# Altium schematic sheet USB_MUX.SchDoc: USB MUX
size A3; Author: Silvio Navaretti; CompanyName: ARDUINO; DrawnBy: Silvio Navaretti; Engineer: Silvio Navaretti; Organization: ARDUINO; SheetNumber: 32; SheetTotal: 51; RevAuthor: Silvio Navaretti
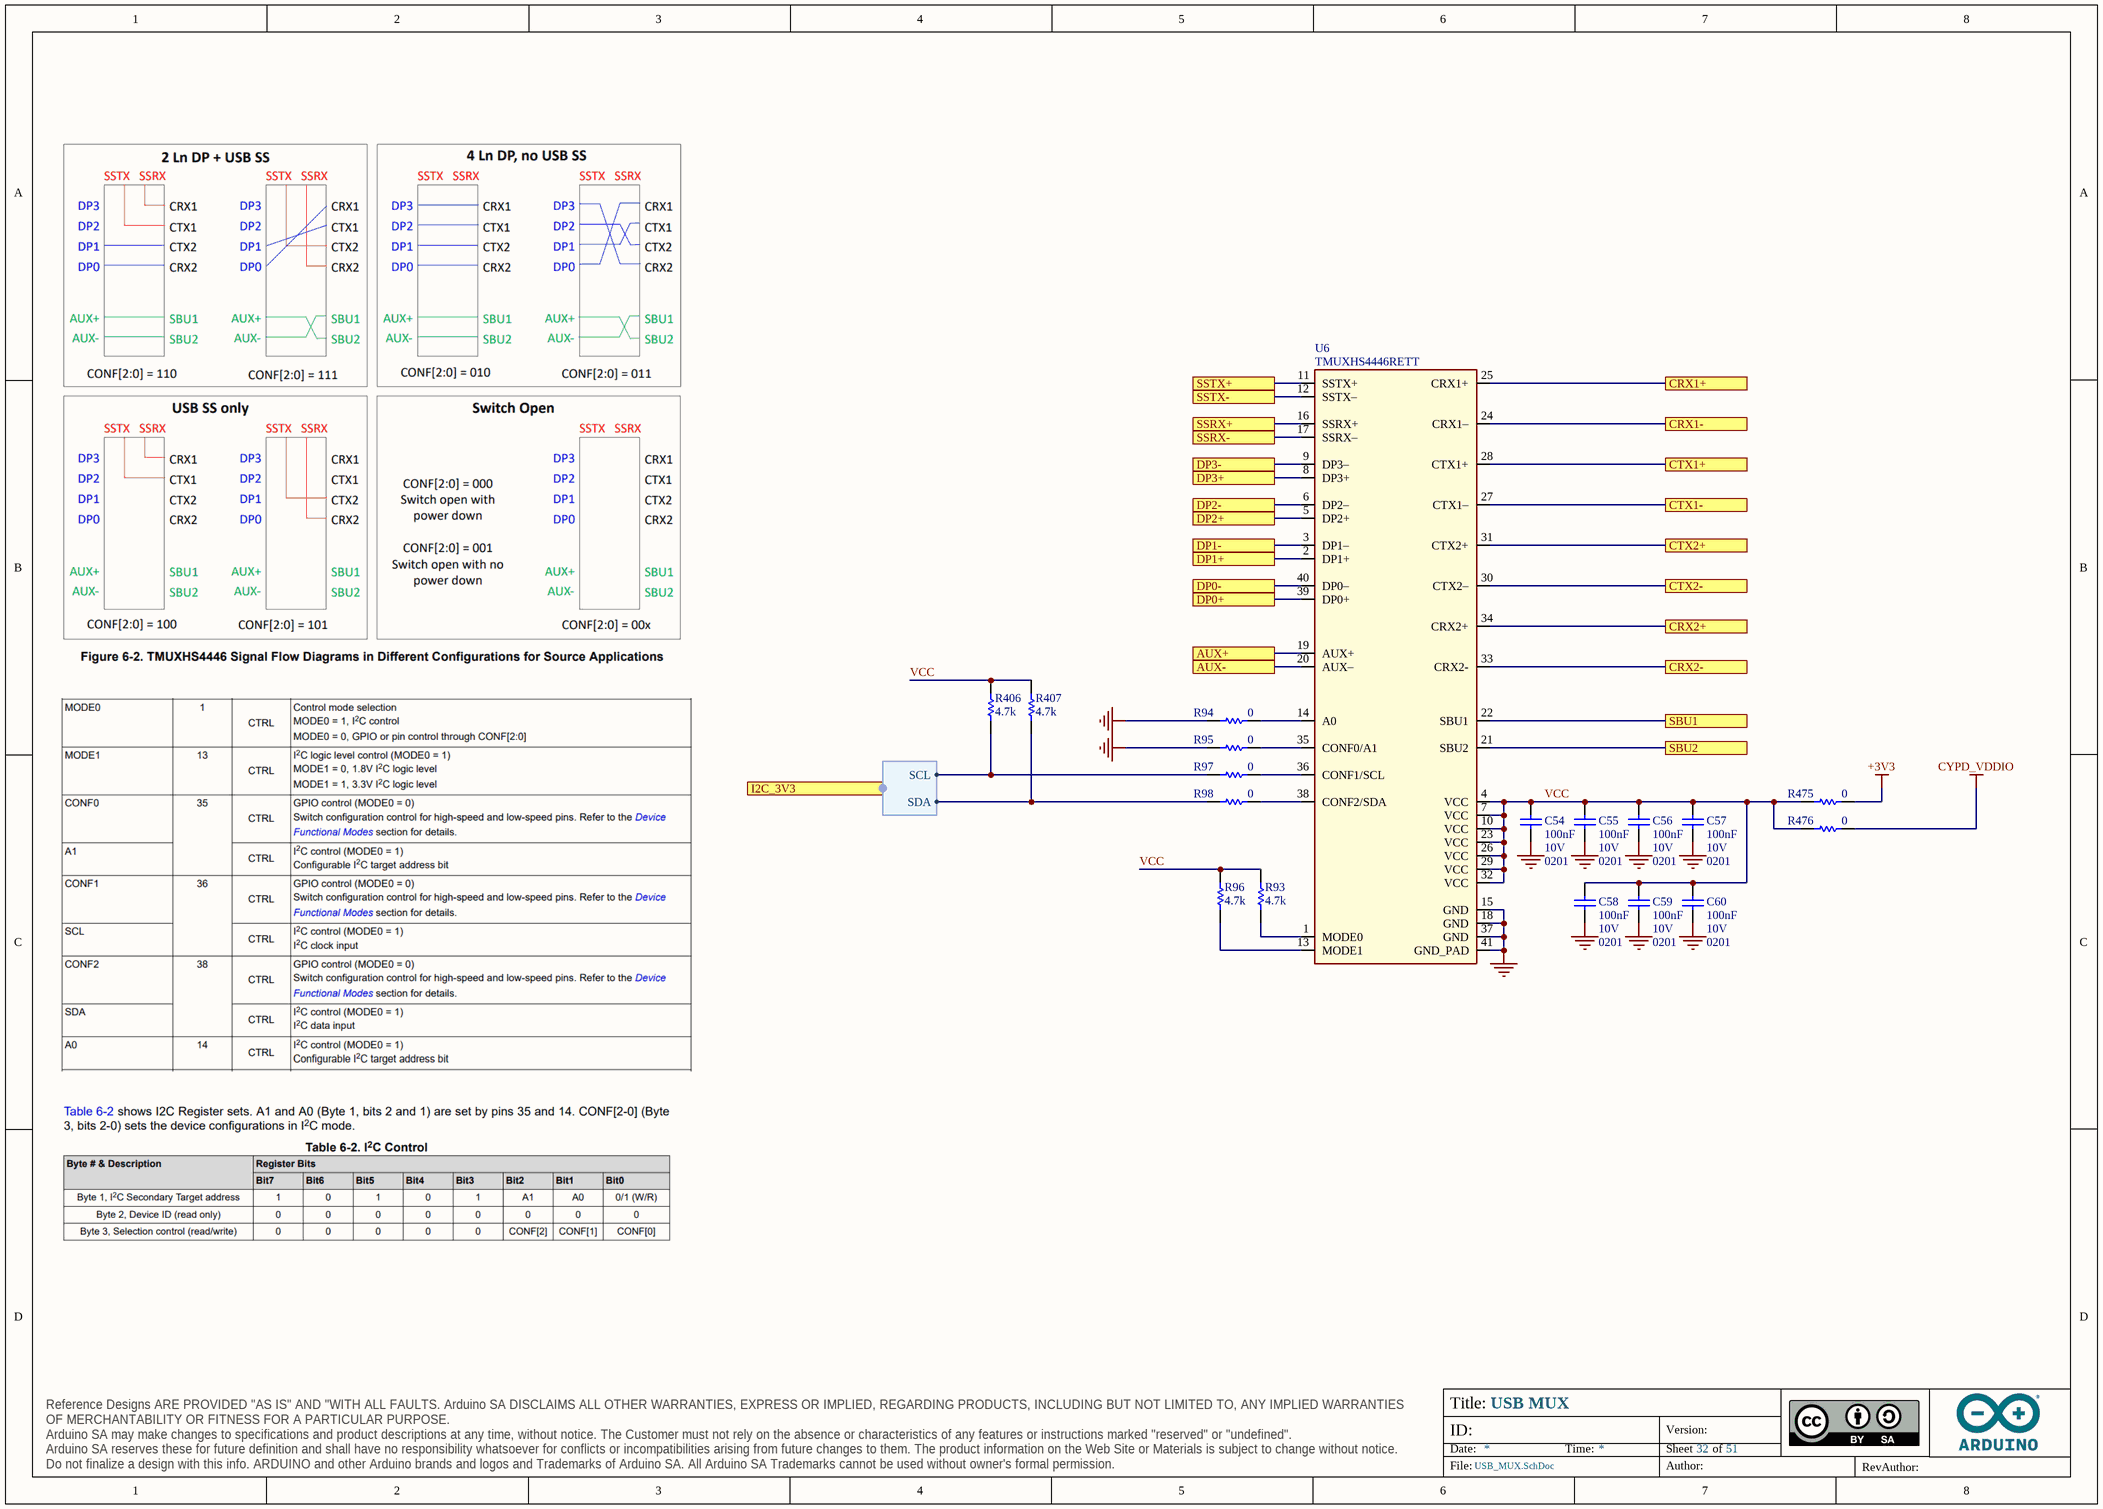
[diagram p0: USB_MUX.SchDoc]

## Parts
C54  value 100nF  Voltage: 10V  Case Code (Imperial): 0201  [CAP-0201]  (hidden comment: CL03A104KP3NNNC)
C55  value 100nF  Voltage: 10V  Case Code (Imperial): 0201  [CAP-0201]  (hidden comment: CL03A104KP3NNNC)
C56  value 100nF  Voltage: 10V  Case Code (Imperial): 0201  [CAP-0201]  (hidden comment: CL03A104KP3NNNC)
C57  value 100nF  Voltage: 10V  Case Code (Imperial): 0201  [CAP-0201]  (hidden comment: CL03A104KP3NNNC)
C58  value 100nF  Voltage: 10V  Case Code (Imperial): 0201  [CAP-0201]  (hidden comment: CL03A104KP3NNNC)
C59  value 100nF  Voltage: 10V  Case Code (Imperial): 0201  [CAP-0201]  (hidden comment: CL03A104KP3NNNC)
C60  value 100nF  Voltage: 10V  Case Code (Imperial): 0201  [CAP-0201]  (hidden comment: CL03A104KP3NNNC)
R93  value 4.7k  [RES-0201]  (hidden comment: RC0201FR-074K7L)
R94  value 0  [RES-0201]  (hidden comment: CRCW02010000Z0ED)
R95  value 0  [RES-0201]  (hidden comment: CRCW02010000Z0ED)
R96  value 4.7k  [RES-0201]  (hidden comment: RC0201FR-074K7L)
R97  value 0  [RES-0201]  (hidden comment: CRCW02010000Z0ED)
R98  value 0  [RES-0201]  (hidden comment: CRCW02010000Z0ED)
R406  value 4.7k  [RES-0201]  (hidden comment: RC0201FR-074K7L)
R407  value 4.7k  [RES-0201]  (hidden comment: RC0201FR-074K7L)
R475  value 0  [RES-0201]  (hidden comment: CRCW02010000Z0ED)
R476  value 0  [RES-0201]  (hidden comment: CRCW02010000Z0ED)
U6  TMUXHS4446RETT  [TI QWFN40 RET0040A Pitch 0.4mm 3x6mm]

## Ports
AUX+, AUX-, CRX1+, CRX1-, CRX2+, CRX2-, CTX1+, CTX1-, CTX2+, CTX2-, DP0+, DP0-, DP1+, DP1-, DP2+, DP2-, DP3+, DP3-, I2C_3V3 (harness I2C), SBU1, SBU2, SSRX+, SSRX-, SSTX+, SSTX-

## Harnesses
I2C: SDA, SCL

## Nets
+3V3: R475.2
CYPD_VDDIO: R476.2
GND: C54.1 C55.1 C56.1 C57.1 C58.1 C59.1 C60.1 R94.1 R95.1 U6.15(GND) U6.18(GND) U6.37(GND) U6.41(GND_PAD)
AUX+: U6.19(AUX+) ; port AUX+
AUX-: U6.20(AUX–) ; port AUX-
CRX1+: U6.25(CRX1+) ; port CRX1+
CRX1-: U6.24(CRX1–) ; port CRX1-
CRX2+: U6.34(CRX2+) ; port CRX2+
CRX2-: U6.33(CRX2-) ; port CRX2-
CTX1+: U6.28(CTX1+) ; port CTX1+
CTX1-: U6.27(CTX1–) ; port CTX1-
CTX2+: U6.31(CTX2+) ; port CTX2+
CTX2-: U6.30(CTX2–) ; port CTX2-
DP0+: U6.39(DP0+) ; port DP0+
DP0-: U6.40(DP0–) ; port DP0-
DP1+: U6.2(DP1+) ; port DP1+
DP1-: U6.3(DP1–) ; port DP1-
DP2+: U6.5(DP2+) ; port DP2+
DP2-: U6.6(DP2–) ; port DP2-
DP3+: U6.8(DP3+) ; port DP3+
DP3-: U6.9(DP3–) ; port DP3-
SBU1: U6.22(SBU1) ; port SBU1
SBU2: U6.21(SBU2) ; port SBU2
SSRX+: U6.16(SSRX+) ; port SSRX+
SSRX-: U6.17(SSRX–) ; port SSRX-
SSTX+: U6.11(SSTX+) ; port SSTX+
SSTX-: U6.12(SSTX–) ; port SSTX-
VCC: C54.2 C55.2 C56.2 C57.2 C58.2 C59.2 C60.2 R93.1 R96.1 R406.1 R407.1 R475.1 R476.1 U6.4(VCC) U6.7(VCC) U6.10(VCC) U6.23(VCC) U6.26(VCC) U6.29(VCC) U6.32(VCC)
NetR93_2: R93.2 U6.1(MODE0)
NetR94_2: R94.2 U6.14(A0)
NetR95_2: R95.2 U6.35(CONF0/A1)
NetR96_2: R96.2 U6.13(MODE1)
NetR97_1: R97.1 R406.2 ; port I2C_3V3.SCL
NetR97_2: R97.2 U6.36(CONF1/SCL)
NetR98_1: R98.1 R407.2 ; port I2C_3V3.SDA
NetR98_2: R98.2 U6.38(CONF2/SDA)

## Notes on the sheet
- Title:
- ID:
- Date:
- Time:
- Version:
- Sheet
- of
- RevAuthor:
- Reference Designs ARE PROVIDED "AS IS" AND "WITH ALL FAULTS. Arduino SA DISCLAIMS ALL OTHER WARRANTIES, EXPRESS OR IMPLIED, REGARDING PRODUCTS, INCLUDING BUT NOT LIMITED TO, ANY IMPLIED WARRANTIES OF MERCHANTABILITY OR FITNESS FOR A PARTICULAR PURPOSE.
  Arduino SA may make changes to specifications and product descriptions at any time, without notice. The Customer must not rely on the absence or characteristics of any features or instructions marked "reserved" or "undefined".
  Arduino SA reserves these for future definition and shall have no responsibility whatsoever for conflicts or incompatibilities arising from future changes to them. The product information on the Web Site or Materials is subject to change without notice.
  Do not finalize a design with this info. ARDUINO and other Arduino brands and logos and Trademarks of Arduino SA. All Arduino SA Trademarks cannot be used without owner's formal permission.
- File:
- Author:

## Library data of the parts
C54-C60 = C0113-A.6: CAP CHIP 0201 100nF 10% 10V X5R; Manufacturer: Samsung Electro-Mechanics; Code Arduino: C0113; Technology: Ceramic; Part Number: CL03A104KP3NNNC; Dielectric: X5R; Tolerance: 10%
R93 R96 R406 R407 = R0151-A.21: RES CHIP 0201 4k7 1% 1/20W; Manufacturer: Yageo; Temperature coefficient: 200ppm; Power: 50mW; Code Arduino: A5521; Technology: Thick film; Case Code (Imperial): 0201; Part Number: RC0201FR-074K7L; Tolerance: 1%
R94 R95 R97 R98 R475 R476 = R0140-A.21: RES CHIP 0201 0R; Manufacturer: Vishay; Temperature coefficient: 0ppm; Code Arduino: R0140; Power: 50mW; Tolerance: 0%; Technology: Thick film; Case Code (Imperial): 0201; Part Number: CRCW02010000Z0ED
U6 = U0499-A.3: IC MUX Alt Mode Crossbar USB-C 10Gbps, QFN40 3x6mm; Manufacturer: Texas Instruments; Code Arduino: U0499; Part Number: TMUXHS4446RETT